# Altium project KIT_STM32F103C8T6_V2.PrjPcb
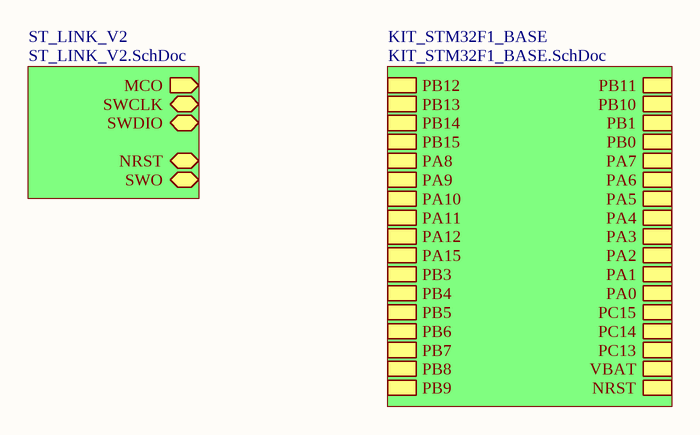
[diagram p0: KIT_STM32F103C8T6_V2.SchDoc]
3 sheets, 37 parts. Net scope: hierarchical (ports join the sheet entries above them; power ports are global).
Board file: KIT_STM32F103C8T6_V2.PcbDoc
Sheets:
  KIT_STM32F103C8T6_V2.SchDoc
    ST_LINK_V2 = ST_LINK_V2.SchDoc
    KIT_STM32F1_BASE = KIT_STM32F1_BASE.SchDoc

## Sheet KIT_STM32F103C8T6_V2.SchDoc
size A

### Sub-sheets
KIT_STM32F1_BASE = KIT_STM32F1_BASE.SchDoc: PB12, PB13, PB14, PB15, PA8, PA9, PA10, PA11, PA12, PA15, PB3, PB4, PB5, PB6, PB7, PB8, PB9, PB11, PB10, PB1, PB0, PA7, PA6, PA5, PA4, PA3, PA2, PA1, PA0, PC15, PC14, PC13, VBAT, NRST
ST_LINK_V2 = ST_LINK_V2.SchDoc: SWCLK (bidir), SWDIO (bidir), NRST (bidir), SWO (bidir), MCO (out)

## Sheet ST_LINK_V2.SchDoc
size A
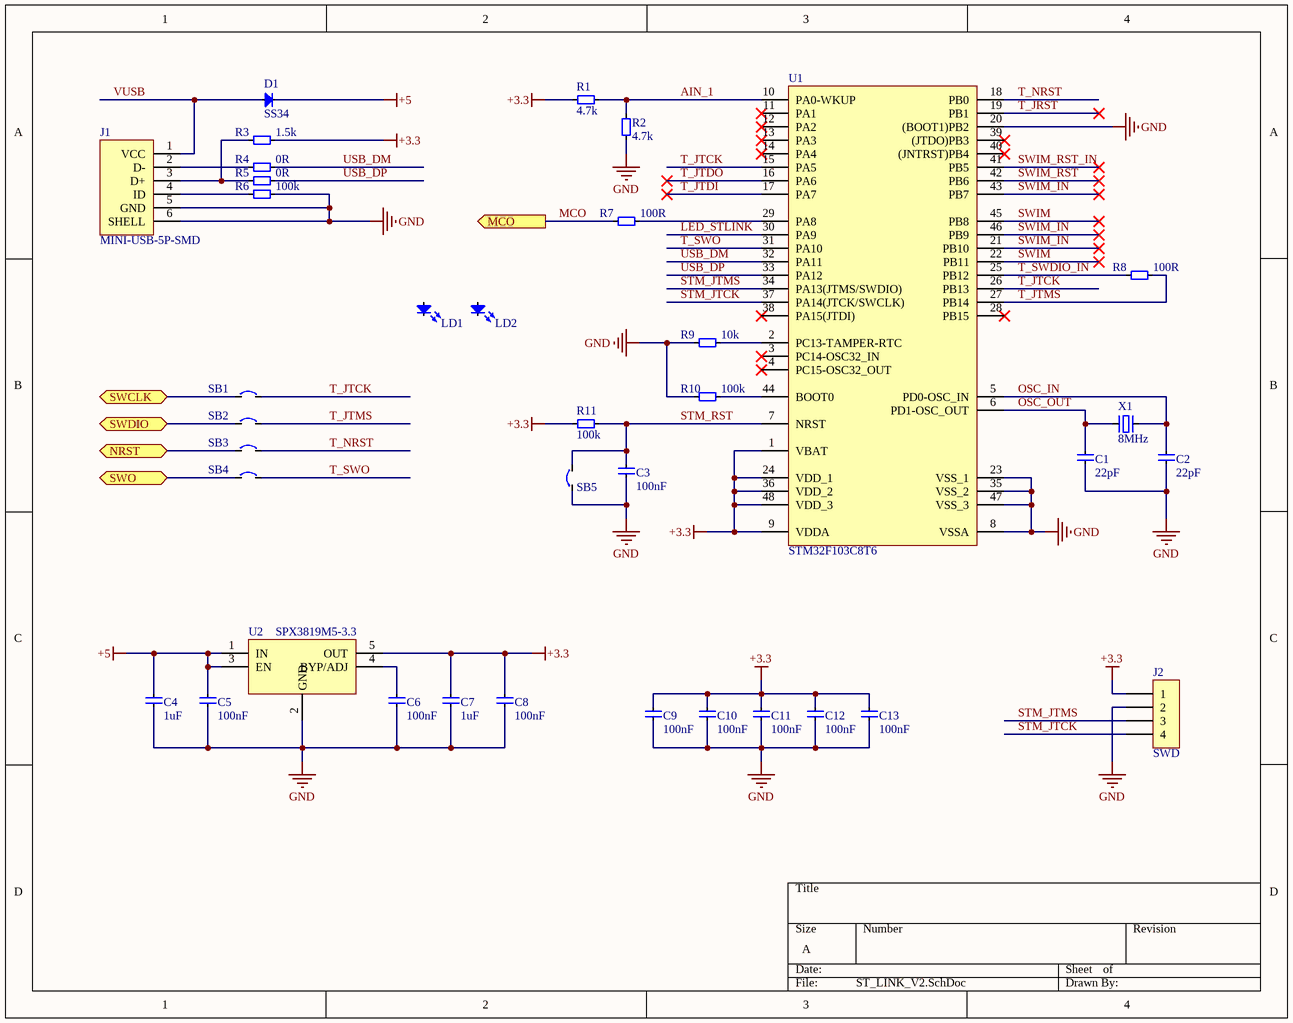
[diagram p1: ST_LINK_V2.SchDoc]

### Parts
C1  22pF  [C0805]
C2  22pF  [C0805]
C3  100nF  [C0805]
C4  1uF  [C1206]
C5  100nF  [C0805]
C6  100nF  [C0805]
C7  1uF  [C1206]
C8  100nF  [C0805]
C9  100nF  [C0805]
C10  100nF  [C0805]
C11  100nF  [C0805]
C12  100nF  [C0805]
C13  100nF  [C0805]
D1  SS34  [DO-214AC-SMA]
J1  MINI-USB-5P-SMD  [MINI-USB-5P-SMD]
J2  SWD  [JP1X4M-2.54]
LD1  LED  (value not drawn)
LD2  LED  (value not drawn)
R1  4.7k  [R0805]
R2  4.7k  [R0805]
R3  1.5k  [R0805]
R4  0R  [R0805]
R5  0R  [R0805]
R6  100k  [R0805]
R7  100R  [R0805]
R8  100R  [R0805]
R9  10k  [R0805]
R10  100k  [R0805]
R11  100k  [R0805]
SB1  SB2-NO  [SB2-NO-ROUND]  (value not drawn)
SB2  SB2-NO  [SB2-NO-ROUND]  (value not drawn)
SB3  SB2-NO  [SB2-NO-ROUND]  (value not drawn)
SB4  SB2-NO  [SB2-NO-ROUND]  (value not drawn)
SB5  SB2-NO  [SB2-NO-ROUND]  (value not drawn)
U1  STM32F103C8T6  [LQFP48-0.5-7X7MM]
U2  SPX3819M5-3.3  [SOT23-5]
X1  8MHz  [XTAL-HC49US]

### Ports
MCO (out), NRST (bidir), SWCLK (bidir), SWDIO (bidir), SWO (bidir)

### Nets
+3.3: C7.1 C8.1 C9.1 C10.1 C11.1 C12.1 C13.1 J2.1 R1.2 R3.2 R11.2 U1.1(VBAT) U1.9(VDDA) U1.24(VDD_1) U1.36(VDD_2) U1.48(VDD_3) U2.5(OUT)
+5: C4.1 C5.1 D1.1 U2.1(IN) U2.3(EN)
GND: C1.1 C2.1 C3.1 C4.2 C5.2 C6.1 C7.2 C8.2 C9.2 C10.2 C11.2 C12.2 C13.2 J1.5(GND) J1.6(SHELL) J2.2 R2.1 R6.2 R9.2 R10.2 SB5.1 U1.8(VSSA) U1.20((BOOT1)PB2) U1.23(VSS_1) U1.35(VSS_2) U1.47(VSS_3) U2.2(GND)
AIN_1: R1.1 R2.2 U1.10(PA0-WKUP)
LED_STLINK: U1.30(PA9)
MCO: R7.2 ; port MCO
OSC_IN: C2.2 U1.5(PD0-OSC_IN) X1.1
OSC_OUT: C1.2 U1.6(PD1-OSC_OUT) X1.2
STM_JTCK: J2.4 U1.37(PA14(JTCK/SWCLK))
STM_JTMS: J2.3 U1.34(PA13(JTMS/SWDIO))
STM_RST: C3.2 R11.1 SB5.2 U1.7(NRST)
SWIM: U1.22(PB11) U1.45(PB8)
SWIM_IN: U1.21(PB10) U1.43(PB7) U1.46(PB9)
SWIM_RST: U1.42(PB6)
SWIM_RST_IN: U1.41(PB5)
T_JRST: U1.19(PB1)
T_JTCK: SB1.2 U1.15(PA5) U1.26(PB13)
T_JTDI: U1.17(PA7)
T_JTDO: U1.16(PA6)
T_JTMS: R8.1 SB2.2 U1.27(PB14)
T_NRST: SB3.2 U1.18(PB0)
T_SWDIO_IN: R8.2 U1.25(PB12)
T_SWO: SB4.2 U1.31(PA10)
USB_DM: R4.2 U1.32(PA11)
USB_DP: R5.2 U1.33(PA12)
VUSB: D1.2 J1.1(VCC)
NetC6_2: C6.2 U2.4(BYP/ADJ)
NetJ1_2: J1.2(D-) R4.1
NetJ1_3: J1.3(D+) R3.1 R5.1
NetJ1_4: J1.4(ID) R6.1
NetR7_1: R7.1 U1.29(PA8)
NetR9_1: R9.1 U1.2(PC13-TAMPER-RTC)
NetR10_1: R10.1 U1.44(BOOT0)
NetSB1_1: SB1.1 ; port SWCLK
NetSB2_1: SB2.1 ; port SWDIO
NetSB3_1: SB3.1 ; port NRST
NetSB4_1: SB4.1 ; port SWO

Not connected (* = marked no-connect by the designer): LD1 1 2; LD2 1 2; U1 3(PC14-OSC32_IN)* 4(PC15-OSC32_OUT)* 11(PA1)* 12(PA2)* 13(PA3)* 14(PA4)* 28(PB15)* 38(PA15(JTDI))* 39((JTDO)PB3)* 40((JNTRST)PB4)*

### Library data of the parts
C1-C13 = CAP: Cac Loai Tu Khong Phan Cuc
D1 = SS34: Diode Schottky 1N5822 3A 40V Dan
J1 = MINI-USB-5P-SMD: Jack Ket Noi Mini USB 5P Dan
J2 = JP1X4-2.54: Jump Don 4 Chan 2.54mm
LD1 LD2 = LED_SMD: LED Dan Cac Loai
R1-R11 = RES: Cac Loai Dien Tro
SB1-SB5 = SB2-NO: Jump Noi Thiec 2 Chan Thuong Mo
U1 = STM32F103C8T6: VDK 32-Bit ARM Cortex-M3
U2 = SPX3819M5: IC On Ap Tuyen Tinh 500mA
X1 = XTAL-HC49: Thach Anh 2 Chan HC49

## Sheet KIT_STM32F1_BASE.SchDoc
size A
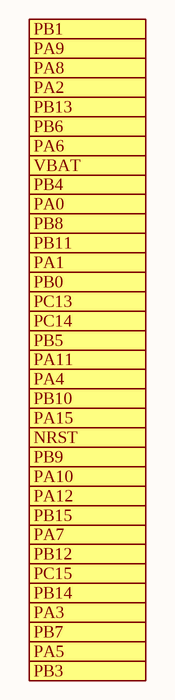
[diagram p2: KIT_STM32F1_BASE.SchDoc]

### Ports
NRST, PA0, PA1, PA2, PA3, PA4, PA5, PA6, PA7, PA8, PA9, PA10, PA11, PA12, PA15, PB0, PB1, PB3, PB4, PB5, PB6, PB7, PB8, PB9, PB10, PB11, PB12, PB13, PB14, PB15, PC13, PC14, PC15, VBAT